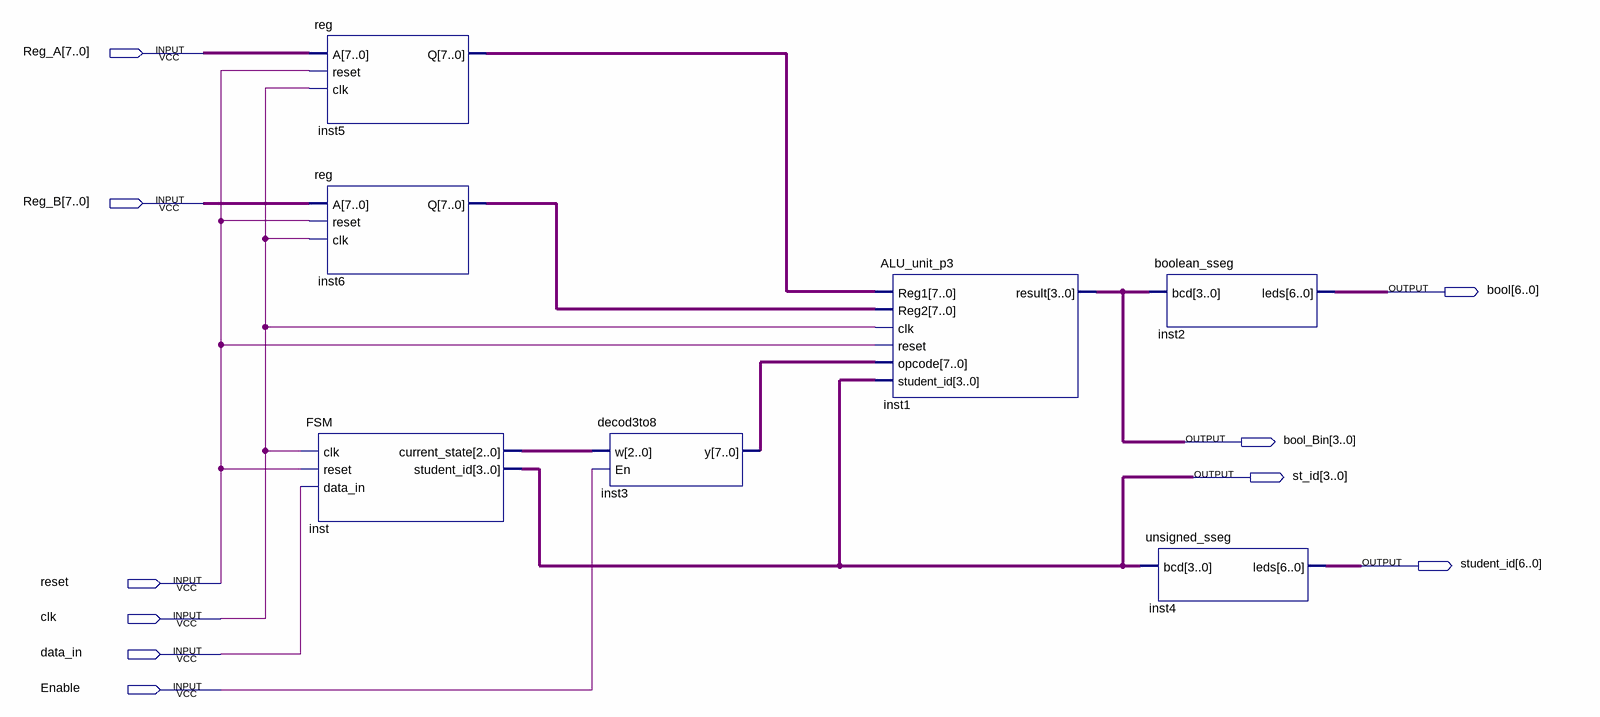
[diagram p0: schematic sheet]
// Quartus schematic Final_Desgin_p3.bdf as structural Verilog: 7 symbols, 10 pins
module Final_Desgin_p3 (
  input  [7:0] Reg_A,
  input  [7:0] Reg_B,
  input  reset,
  input  clk,
  input  data_in,
  input  Enable,
  output [6:0] \bool ,
  output [3:0] bool_Bin,
  output [3:0] st_id,
  output [6:0] student_id
);

  wire [2:0] inst_current_state;
  wire [7:0] inst3_y, inst5_q, inst6_q;

  \reg  inst5 (.A(Reg_A), .reset(reset), .clk(clk), .Q(inst5_q));
  \reg  inst6 (.A(Reg_B), .reset(reset), .clk(clk), .Q(inst6_q));
  FSM inst (.clk(clk), .reset(reset), .data_in(data_in), .current_state(inst_current_state), .student_id(st_id));
  decod3to8 inst3 (.w(inst_current_state), .En(Enable), .y(inst3_y));
  ALU_unit_p3 inst1 (
    .Reg1(inst5_q), .Reg2(inst6_q), .clk(clk), .reset(reset), .opcode(inst3_y), .student_id(st_id),
    .result(bool_Bin));
  boolean_sseg inst2 (.bcd(bool_Bin), .leds(\bool ));
  unsigned_sseg inst4 (.bcd(st_id), .leds(student_id));
endmodule
